# EAGLE design Operant-Back (EAGLE 9.6.2)
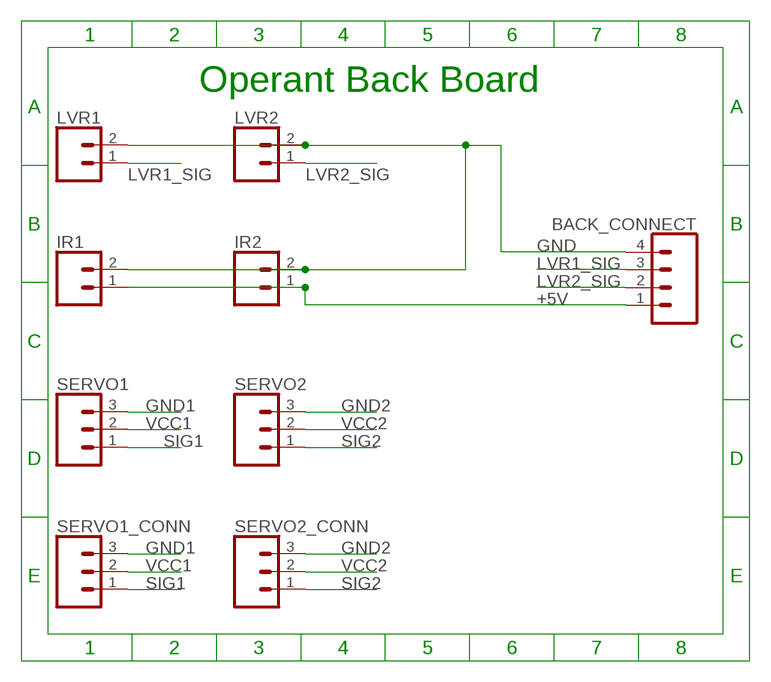
[diagram p0: schematic, sheet 1]

## Parts
BACK_CONNECT  CONN_04JST-PTH  [JST-4-PTH]
IR1  CONN_02JST-PTH-2  [JST-2-PTH]
IR2  CONN_02JST-PTH-2  [JST-2-PTH]
LVR1  CONN_02JST-PTH-2  [JST-2-PTH]
LVR2  CONN_02JST-PTH-2  [JST-2-PTH]
SERVO1  CONN_03  [1X03]
SERVO1_CONN  CONN_03JST-PTH  [JST-3-PTH]
SERVO2  CONN_03  [1X03]
SERVO2_CONN  CONN_03JST-PTH  [JST-3-PTH]

## Nets
+5V: BACK_CONNECT.1 IR1.1 IR2.1
GND: BACK_CONNECT.4 IR1.2 IR2.2 LVR1.2 LVR2.2
GND1: SERVO1.3 SERVO1_CONN.3
GND2: SERVO2.3 SERVO2_CONN.3
LVR1_SIG: BACK_CONNECT.3 LVR1.1
LVR2_SIG: BACK_CONNECT.2 LVR2.1
SIG1: SERVO1.1 SERVO1_CONN.1
SIG2: SERVO2.1 SERVO2_CONN.1
VCC1: SERVO1.2 SERVO1_CONN.2
VCC2: SERVO2.2 SERVO2_CONN.2

## Notes on the sheet
- Operant Back Board

## Library data of the parts
BACK_CONNECT = SparkFun-Connectors:CONN_04: Multi connection point. Often used as Generic Header-pin footprint for 0.1 inch spaced/style header connections On any of the 0.1 inch spaced packages, you can populate with these: Break Away Headers - Straight <https://www.sparkfun.com/products/116> (PRT-00116) Break Away Male Headers - Right Angle <https://www.sparkfun.com/products/553> (PRT-00553) Female Headers <https://www.sparkfun.com/products/115> (PRT-00115) Break Away Headers - Machine Pin <https://www.sparkfun.com/products/117> (PRT-00117) Break Away Female Headers - Swiss Machine Pin <https://www.sparkfun.com/products/743> (PRT-00743) For SCREWTERMINALS and SPRING TERMINALS visit here: Screw Terimnals on SparkFun.com <https://www.sparkfun.com/search/results?term=Screw+Terminals> (5mm/3.5mm/2.54mm spacing) This device is also useful as a general connection point to wire up your design to another part of your project. Our various solder wires solder well into these plated through hole pads. Hook-Up Wire - Assortment (Stranded, 22 AWG) <https://www.sparkfun.com/products/11375> (PRT-11375) Hook-Up Wire - Assortment (Solid Core, 22 AWG) <https://www.sparkfun.com/products/11367> (PRT-11367) View the entire wire category on our website here <https://www.sparkfun.com/categories/141> Special notes: Molex polarized connector foot print use with SKU : PRT-08231 with associated crimp pins and housings. 1MM SMD Version SKU: PRT-10208; PROD_ID: WIRE-13531; SF_ID: PRT-09916
IR1 IR2 LVR1 LVR2 = SparkFun-Connectors:CONN_02: Multi connection point. Often used as Generic Header-pin footprint for 0.1 inch spaced/style header connections On any of the 0.1 inch spaced packages, you can populate with these: Break Away Headers - Straight <https://www.sparkfun.com/products/116> (PRT-00116) Break Away Male Headers - Right Angle <https://www.sparkfun.com/products/553> (PRT-00553) Female Headers <https://www.sparkfun.com/products/115> (PRT-00115) Break Away Headers - Machine Pin <https://www.sparkfun.com/products/117> (PRT-00117) Break Away Female Headers - Swiss Machine Pin <https://www.sparkfun.com/products/743> (PRT-00743) For SCREWTERMINALS and SPRING TERMINALS visit here: Screw Terimnals on SparkFun.com <https://www.sparkfun.com/search/results?term=Screw+Terminals> (5mm/3.5mm/2.54mm spacing) This device is also useful as a general connection point to wire up your design to another part of your project. Our various solder wires solder well into these plated through hole pads. Hook-Up Wire - Assortment (Stranded, 22 AWG) <https://www.sparkfun.com/products/11375> (PRT-11375) Hook-Up Wire - Assortment (Solid Core, 22 AWG) <https://www.sparkfun.com/products/11367> (PRT-11367) View the entire wire category on our website here <https://www.sparkfun.com/categories/141> Special notes: Molex polarized connector foot print use with: PRT-08233 with associated crimp pins and housings. 2.54_SCREWTERM for use with PRT-10571. 3.5mm Screw Terminal footprints for PRT-08084 5mm Screw Terminal footprints for use with PRT-08432; PROD_ID: CONN-09863; SKU: PRT-09914
SERVO1 SERVO2 = SparkFun-Connectors:CONN_03: Multi connection point. Often used as Generic Header-pin footprint for 0.1 inch spaced/style header connections On any of the 0.1 inch spaced packages, you can populate with these: Break Away Headers - Straight <https://www.sparkfun.com/products/116> (PRT-00116) Break Away Male Headers - Right Angle <https://www.sparkfun.com/products/553> (PRT-00553) Female Headers <https://www.sparkfun.com/products/115> (PRT-00115) Break Away Headers - Machine Pin <https://www.sparkfun.com/products/117> (PRT-00117) Break Away Female Headers - Swiss Machine Pin <https://www.sparkfun.com/products/743> (PRT-00743) Stackable Header - 3 Pin (Female, 0.1") <https://www.sparkfun.com/products/13875> (PRT-13875) For SCREWTERMINALS and SPRING TERMINALS visit here: Screw Terimnals on SparkFun.com <https://www.sparkfun.com/search/results?term=Screw+Terminals> (5mm/3.5mm/2.54mm spacing) This device is also useful as a general connection point to wire up your design to another part of your project. Our various solder wires solder well into these plated through hole pads. Hook-Up Wire - Assortment (Stranded, 22 AWG) <https://www.sparkfun.com/products/11375> (PRT-11375) Hook-Up Wire - Assortment (Solid Core, 22 AWG) <https://www.sparkfun.com/products/11367> (PRT-11367) View the entire wire category on our website here <https://www.sparkfun.com/categories/141> Special notes: Molex polarized connector foot print use with SKU : PRT-08232 with associated crimp pins and housings.; PROD_ID: XXX-00000; VALUE: 455-1750-1-ND
SERVO1_CONN SERVO2_CONN = SparkFun-Connectors:CONN_03: Multi connection point. Often used as Generic Header-pin footprint for 0.1 inch spaced/style header connections On any of the 0.1 inch spaced packages, you can populate with these: Break Away Headers - Straight <https://www.sparkfun.com/products/116> (PRT-00116) Break Away Male Headers - Right Angle <https://www.sparkfun.com/products/553> (PRT-00553) Female Headers <https://www.sparkfun.com/products/115> (PRT-00115) Break Away Headers - Machine Pin <https://www.sparkfun.com/products/117> (PRT-00117) Break Away Female Headers - Swiss Machine Pin <https://www.sparkfun.com/products/743> (PRT-00743) Stackable Header - 3 Pin (Female, 0.1") <https://www.sparkfun.com/products/13875> (PRT-13875) For SCREWTERMINALS and SPRING TERMINALS visit here: Screw Terimnals on SparkFun.com <https://www.sparkfun.com/search/results?term=Screw+Terminals> (5mm/3.5mm/2.54mm spacing) This device is also useful as a general connection point to wire up your design to another part of your project. Our various solder wires solder well into these plated through hole pads. Hook-Up Wire - Assortment (Stranded, 22 AWG) <https://www.sparkfun.com/products/11375> (PRT-11375) Hook-Up Wire - Assortment (Solid Core, 22 AWG) <https://www.sparkfun.com/products/11367> (PRT-11367) View the entire wire category on our website here <https://www.sparkfun.com/categories/141> Special notes: Molex polarized connector foot print use with SKU : PRT-08232 with associated crimp pins and housings.; PROD_ID: WIRE-10037; SF_ID: PRT-09915

## Board
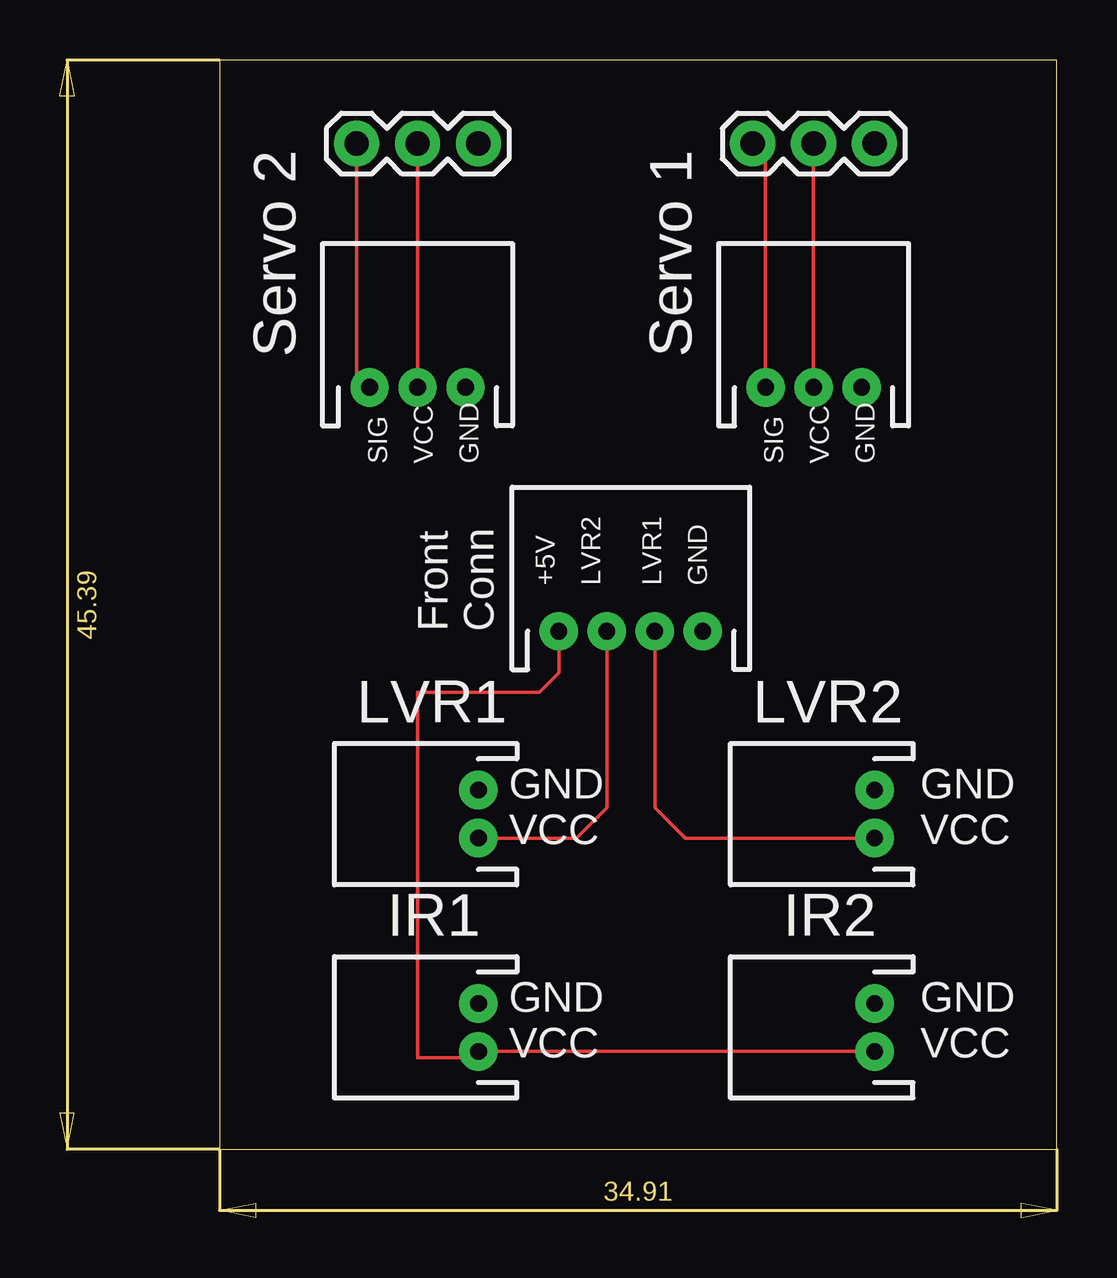
[diagram p1: board, top side]
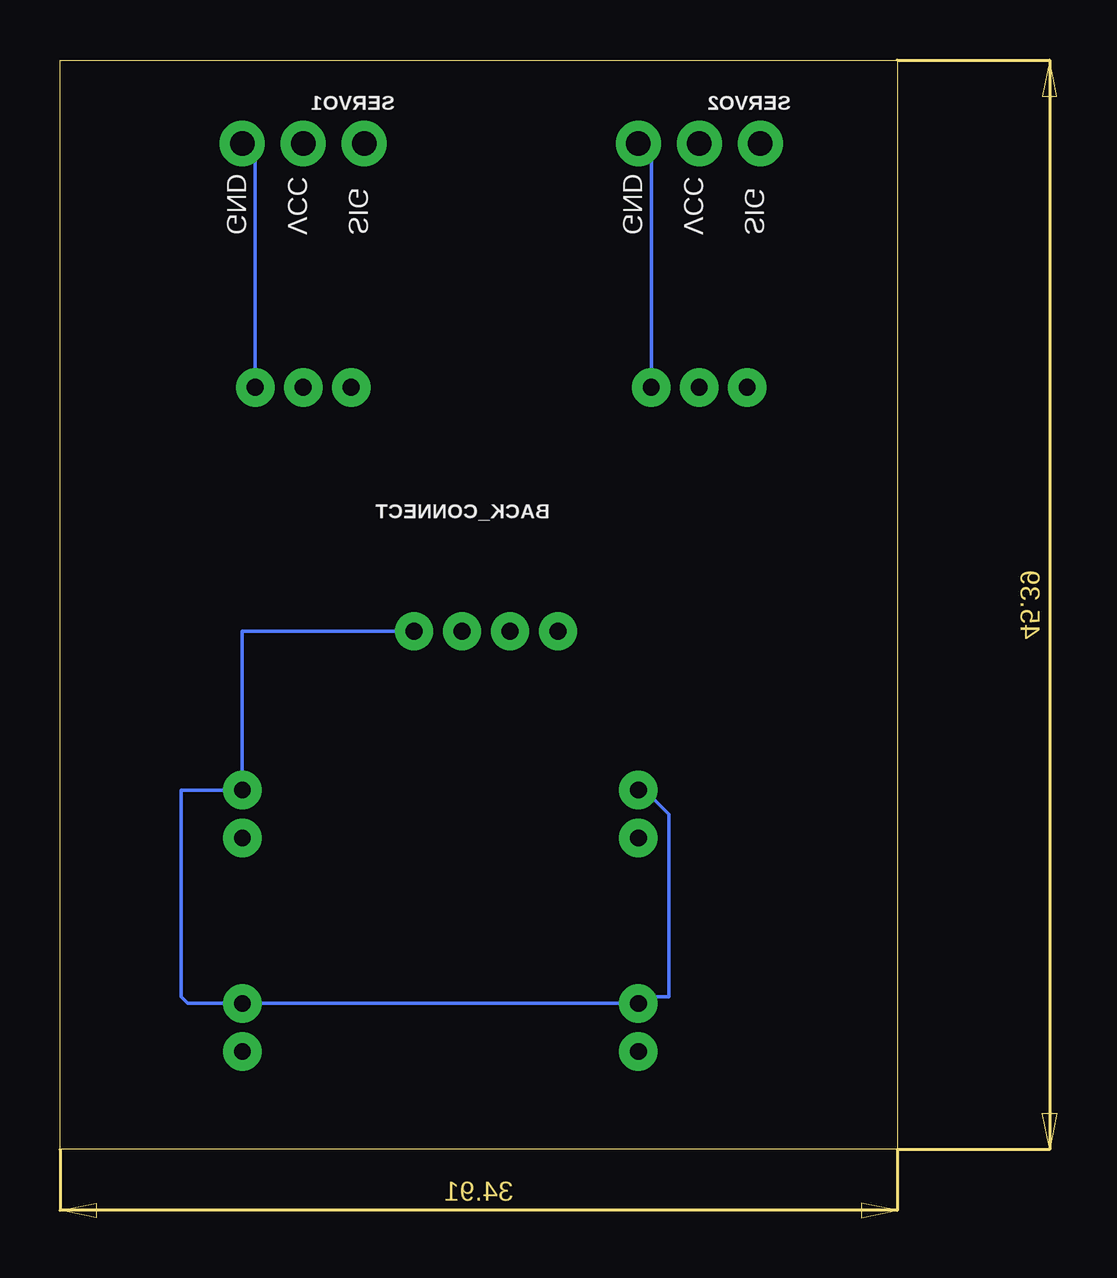
[diagram p2: board, bottom side, seen from below]

Size 34.91 x 45.39 mm. Coordinates in mm from the lower left corner, seen from the top.
Outline: 0,0 34.91,0 34.91,45.39 0,45.39 0,0
Copper layers (1*16): Top 0.035mm / dielectric 1.5mm / Bottom 0.035mm
Design rules "default": minimum track width 6mil, minimum drill 0.35mm, track to track 6mil, track to pad 6mil, pad to pad 6mil, via to via 6mil, smd to smd 6mil, copper to edge 40mil, drill to drill 6mil, minimum pad ring 10mil, minimum via ring 8mil, stop-mask expansion 4mil, vias tented up to drill 0mil, thermal gap 10mil

### Footprints (pad centres in the part's own frame; a part is rotated, then mirrored left to right if it is on the bottom)
JST-4-PTH = drill 0.7 pad 1.6: 1 -3,0; 2 -1,0; 3 1,0; 4 3,0
JST-2-PTH = drill 0.7 pad 1.6: 1 -1,0; 2 1,0
1X03 = drill 1.016 pad 1.88: 1 0,0; 2 2.54,0; 3 5.08,0
JST-3-PTH = drill 0.7 pad 1.6: 1 -2,0; 2 0,0; 3 2,0

### Placement (x,y rotation side)
BACK_CONNECT  17.14,21.59 0 top
IR1  27.3,5.08 90 top
IR2  10.79,5.08 90 top
LVR1  27.3,13.97 90 top
LVR2  10.79,13.97 90 top
SERVO1  22.23,41.91 0 top
SERVO1_CONN  24.77,31.75 0 top
SERVO2  5.71,41.91 0 top
SERVO2_CONN  8.26,31.75 0 top

### Tracks (layer width: path | path; a pad name or v marks a point on that pad's centre or on a via)
+5V
  Top 0.152: BACK_CONNECT.1 14.14,19.86 13.34,19.05 8.26,19.05 8.26,3.81 10.53,3.81 IR2.1 IR1.1
GND
  Bottom 0.152: BACK_CONNECT.4 27.3,21.59 LVR1.2 29.84,14.97 29.84,6.35 29.57,6.08 IR1.2 IR2.2 10.53,6.35 9.53,6.35 9.53,13.97 10.53,14.97 LVR2.2
GND1
  Bottom 0.152: SERVO1_CONN.3 26.77,41.37 SERVO1.3
GND2
  Bottom 0.152: SERVO2_CONN.3 10.26,41.37 SERVO2.3
LVR1_SIG
  Top 0.152: LVR1.1 19.41,12.97 18.14,14.24 BACK_CONNECT.3
LVR2_SIG
  Top 0.152: LVR2.1 14.88,12.97 16.14,14.24 BACK_CONNECT.2
SIG1
  Top 0.152: SERVO1.1 22.77,41.37 SERVO1_CONN.1
SIG2
  Top 0.152: SERVO2.1 5.71,32.29 SERVO2_CONN.1
VCC1
  Top 0.152: SERVO1.2 SERVO1_CONN.2
VCC2
  Top 0.152: SERVO2.2 SERVO2_CONN.2

### Text on the board
tPlace: Servo 2 | Servo 1 | SIG | VCC | GND | SIG | VCC | GND | +5V | LVR2 | LVR1 | GND | Front / Conn | LVR1 | LVR2 | GND | GND | VCC | VCC | IR1 | IR2 | GND | GND | VCC | VCC
bPlace: SIG | VCC | GND | SIG | VCC | GND